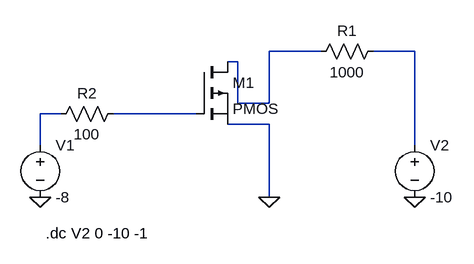
[diagram p0: schematic PMOS_Rita.asc]
PMOS_Rita.asc, the LTspice schematic file:
Version 4
SHEET 1 880 680
WIRE 416 64 336 64
WIRE 560 64 496 64
WIRE 288 80 272 80
WIRE 288 144 288 80
WIRE 336 144 336 64
WIRE 336 144 288 144
WIRE 16 160 -16 160
WIRE 224 160 96 160
WIRE 336 176 272 176
WIRE -16 208 -16 160
WIRE 560 208 560 64
WIRE 336 288 336 176
FLAG -16 288 0
FLAG 336 288 0
FLAG 560 288 0
SYMBOL res 512 48 R90
WINDOW 0 0 56 VBottom 2
WINDOW 3 32 56 VTop 2
SYMATTR InstName R1
SYMATTR Value 1000
SYMBOL res 112 144 R90
WINDOW 0 0 56 VBottom 2
WINDOW 3 32 56 VTop 2
SYMATTR InstName R2
SYMATTR Value 100
SYMBOL voltage -16 192 R0
WINDOW 123 0 0 Left 0
WINDOW 39 0 0 Left 0
SYMATTR InstName V1
SYMATTR Value -8
SYMBOL voltage 560 192 R0
WINDOW 123 0 0 Left 0
WINDOW 39 0 0 Left 0
SYMATTR InstName V2
SYMATTR Value -10
SYMBOL pmos 224 80 R0
SYMATTR InstName M1
TEXT -8 344 Left 2 !.dc V2 0 -10 -1

The netlist it stands for:
* PMOS_Rita.asc
R1 N002 N001 1000
R2 N004 N003 100
V1 N003 0 -8
V2 N002 0 -10
M1 N001 N004 0 0 PMOS
.model NMOS NMOS
.model PMOS PMOS
.lib standard.mos
.dc V2 0 -10 -1
.backanno
.end